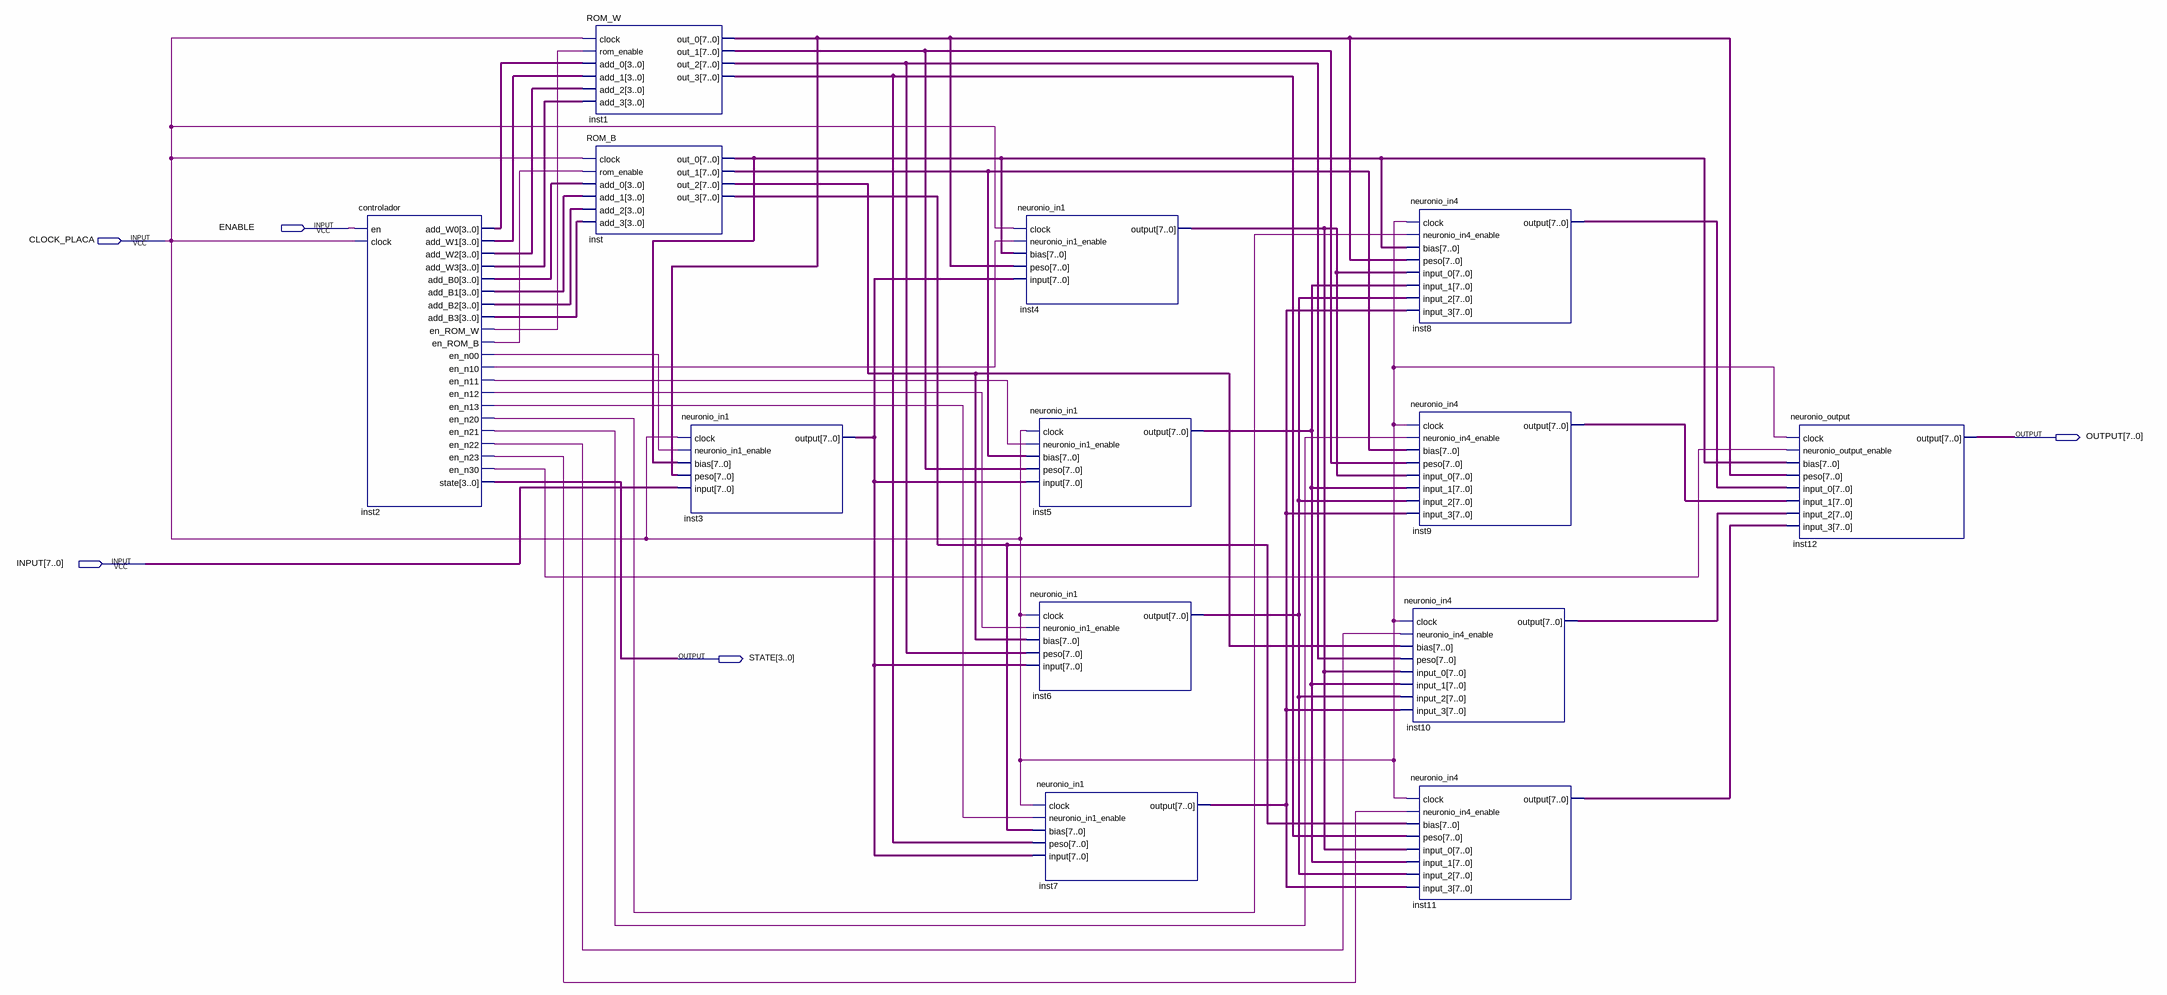
[diagram p0: schematic sheet]
// Quartus schematic rede_neural.bdf as structural Verilog: 13 symbols, 5 pins
module rede_neural (
  input  ENABLE,
  input  CLOCK_PLACA,
  input  [7:0] INPUT,
  output [7:0] OUTPUT,
  output [3:0] STATE
);

  wire inst2_en_n00, inst2_en_n10, inst2_en_n11, inst2_en_n12, inst2_en_n13, inst2_en_n20, inst2_en_n21,
       inst2_en_n22, inst2_en_n23, inst2_en_n30, inst2_en_rom_b, inst2_en_rom_w;
  wire [3:0] inst2_add_b0, inst2_add_b1, inst2_add_b2, inst2_add_b3, inst2_add_w0, inst2_add_w1,
       inst2_add_w2, inst2_add_w3;
  wire [7:0] inst1_out_0, inst1_out_1, inst1_out_2, inst1_out_3, inst3_output, inst4_output, inst5_output,
       inst6_output, inst7_output, inst8_output, inst9_output, inst10_output, inst11_output, inst_out_0,
       inst_out_1, inst_out_2, inst_out_3;

  controlador inst2 (
    .en(ENABLE), .clock(CLOCK_PLACA), .add_W0(inst2_add_w0), .add_W1(inst2_add_w1), .add_W2(inst2_add_w2),
    .add_W3(inst2_add_w3), .add_B0(inst2_add_b0), .add_B1(inst2_add_b1), .add_B2(inst2_add_b2),
    .add_B3(inst2_add_b3), .en_ROM_W(inst2_en_rom_w), .en_ROM_B(inst2_en_rom_b), .en_n00(inst2_en_n00),
    .en_n10(inst2_en_n10), .en_n11(inst2_en_n11), .en_n12(inst2_en_n12), .en_n13(inst2_en_n13),
    .en_n20(inst2_en_n20), .en_n21(inst2_en_n21), .en_n22(inst2_en_n22), .en_n23(inst2_en_n23),
    .en_n30(inst2_en_n30), .state(STATE));
  ROM_W inst1 (
    .clock(CLOCK_PLACA), .rom_enable(inst2_en_rom_w), .add_0(inst2_add_w0), .add_1(inst2_add_w1),
    .add_2(inst2_add_w2), .add_3(inst2_add_w3), .out_0(inst1_out_0), .out_1(inst1_out_1),
    .out_2(inst1_out_2), .out_3(inst1_out_3));
  ROM_B inst (
    .clock(CLOCK_PLACA), .rom_enable(inst2_en_rom_b), .add_0(inst2_add_b0), .add_1(inst2_add_b1),
    .add_2(inst2_add_b2), .add_3(inst2_add_b3), .out_0(inst_out_0), .out_1(inst_out_1), .out_2(inst_out_2),
    .out_3(inst_out_3));
  neuronio_in1 inst3 (
    .clock(CLOCK_PLACA), .neuronio_in1_enable(inst2_en_n00), .bias(inst_out_0), .peso(inst1_out_0),
    .\input (INPUT), .\output (inst3_output));
  neuronio_in1 inst4 (
    .clock(CLOCK_PLACA), .neuronio_in1_enable(inst2_en_n10), .bias(inst_out_0), .peso(inst1_out_0),
    .\input (inst3_output), .\output (inst4_output));
  neuronio_in1 inst5 (
    .clock(CLOCK_PLACA), .neuronio_in1_enable(inst2_en_n11), .bias(inst_out_1), .peso(inst1_out_1),
    .\input (inst3_output), .\output (inst5_output));
  neuronio_in1 inst6 (
    .clock(CLOCK_PLACA), .neuronio_in1_enable(inst2_en_n12), .bias(inst_out_2), .peso(inst1_out_2),
    .\input (inst3_output), .\output (inst6_output));
  neuronio_in1 inst7 (
    .clock(CLOCK_PLACA), .neuronio_in1_enable(inst2_en_n13), .bias(inst_out_3), .peso(inst1_out_3),
    .\input (inst3_output), .\output (inst7_output));
  neuronio_in4 inst8 (
    .clock(CLOCK_PLACA), .neuronio_in4_enable(inst2_en_n20), .bias(inst_out_0), .peso(inst1_out_0),
    .input_0(inst4_output), .input_1(inst5_output), .input_2(inst6_output), .input_3(inst7_output),
    .\output (inst8_output));
  neuronio_in4 inst9 (
    .clock(CLOCK_PLACA), .neuronio_in4_enable(inst2_en_n21), .bias(inst_out_1), .peso(inst1_out_1),
    .input_0(inst4_output), .input_1(inst5_output), .input_2(inst6_output), .input_3(inst7_output),
    .\output (inst9_output));
  neuronio_in4 inst10 (
    .clock(CLOCK_PLACA), .neuronio_in4_enable(inst2_en_n22), .bias(inst_out_2), .peso(inst1_out_2),
    .input_0(inst4_output), .input_1(inst5_output), .input_2(inst6_output), .input_3(inst7_output),
    .\output (inst10_output));
  neuronio_in4 inst11 (
    .clock(CLOCK_PLACA), .neuronio_in4_enable(inst2_en_n23), .bias(inst_out_3), .peso(inst1_out_3),
    .input_0(inst4_output), .input_1(inst5_output), .input_2(inst6_output), .input_3(inst7_output),
    .\output (inst11_output));
  neuronio_output inst12 (
    .clock(CLOCK_PLACA), .neuronio_output_enable(inst2_en_n30), .bias(inst_out_0), .peso(inst1_out_0),
    .input_0(inst8_output), .input_1(inst9_output), .input_2(inst10_output), .input_3(inst11_output),
    .\output (OUTPUT));
endmodule
